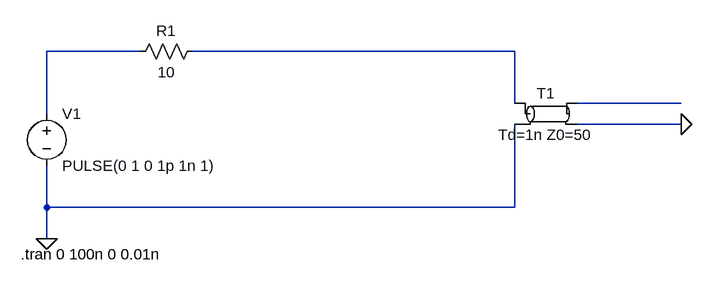
[diagram p0: schematic p12.asc]
p12.asc, the LTspice schematic file:
Version 4.1
SHEET 1 1188 680
WIRE 336 -16 192 -16
WIRE 912 -16 416 -16
WIRE 912 64 912 -16
WIRE 1168 64 1008 64
WIRE 192 80 192 -16
WIRE 1168 96 1008 96
WIRE 192 224 192 160
WIRE 912 224 912 96
WIRE 912 224 192 224
WIRE 192 272 192 224
FLAG 192 272 0
FLAG 1168 96 0
SYMBOL voltage 192 64 R0
WINDOW 123 0 0 Left 0
WINDOW 39 0 0 Left 0
SYMATTR InstName V1
SYMATTR Value PULSE(0 1 0 1p 1n 1)
SYMBOL res 432 -32 R90
WINDOW 0 0 56 VBottom 2
WINDOW 3 32 56 VTop 2
SYMATTR InstName R1
SYMATTR Value 10
SYMBOL tline 960 80 R0
SYMATTR InstName T1
SYMATTR Value Td=1n Z0=50
TEXT 152 296 Left 2 !.tran 0 100n 0 0.01n

The netlist it stands for:
* p12.asc
V1 N001 0 PULSE(0 1 0 1p 1n 1)
R1 N002 N001 10
T1 N002 0 N003 0 Td=1n Z0=50
.tran 0 100n 0 0.01n
.backanno
.end